# EAGLE schematic Schematic_RoleaTheodorIoan_333CA (EAGLE 9.7.0)
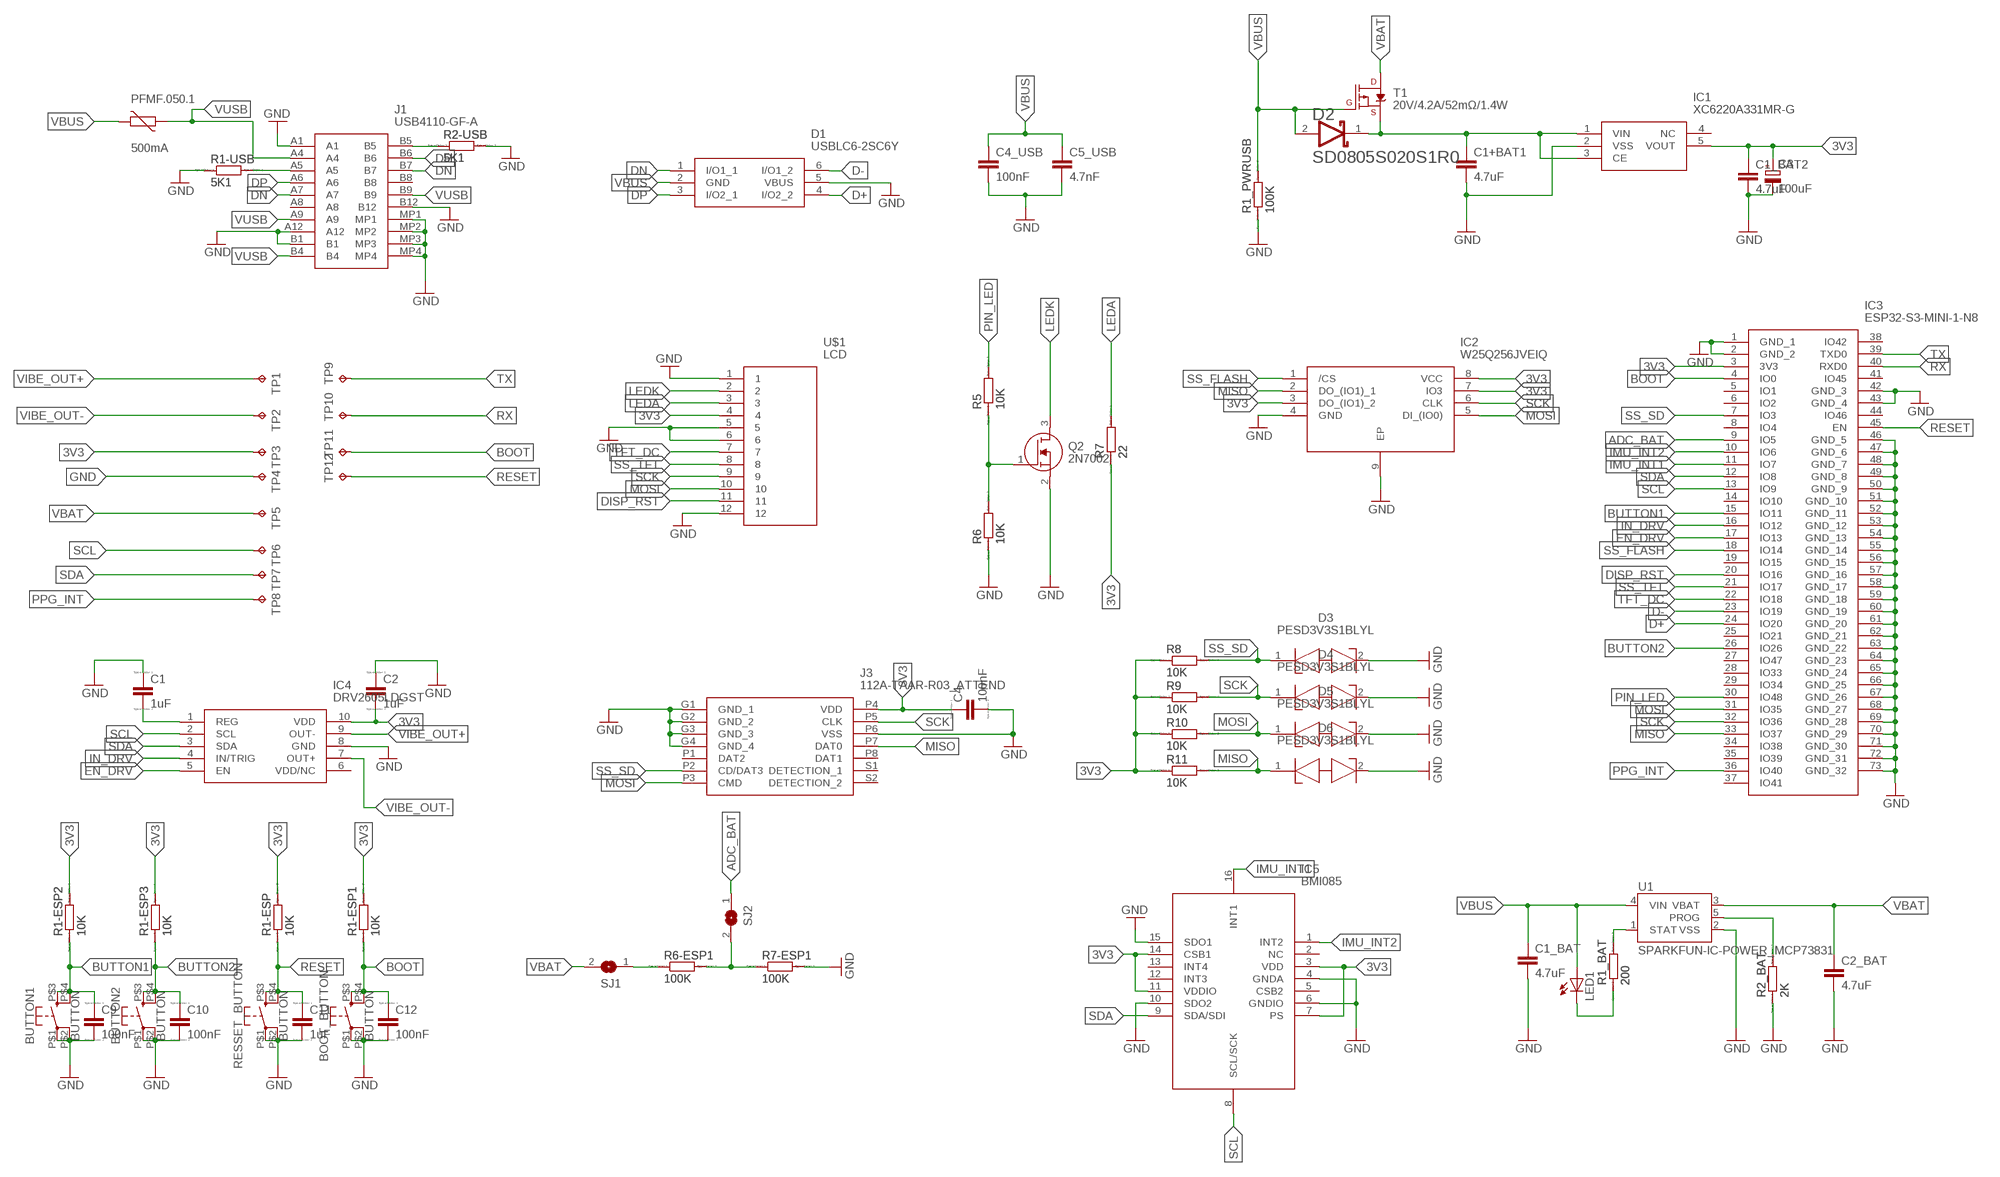
[diagram p0: schematic, sheet 1]

## Parts
BOOT_BUTTON  BUTTON  [BUTTON]
BUTTON1  BUTTON  [BUTTON]
BUTTON2  BUTTON  [BUTTON]
C1  1uF  EAGLE-LTSPICE_CC0402  [EAGLE-LTSPICE_C0402]
C1+BAT1  4.7uF  RCL_C-EUC0603  [RCL_C0603]
C1_BAT  4.7uF  RCL_C-EUC0603  [RCL_C0603]
C1_BAT2  4.7uF  RCL_C-EUC0603  [RCL_C0603]
C2  1uF  EAGLE-LTSPICE_CC0402  [EAGLE-LTSPICE_C0402]
C2_BAT  4.7uF  RCL_C-EUC0603  [RCL_C0603]
C3  100uF  CPOL-EUCT3528  [CT3528]
C4  100nF  EAGLE-LTSPICE_CC0402  [EAGLE-LTSPICE_C0402]
C4_USB  100nF  RCL_C-EUC0603  [RCL_C0603]
C5_USB  4.7nF  RCL_C-EUC0603  [RCL_C0603]
C9  100nF  EAGLE-LTSPICE_CC0402  [EAGLE-LTSPICE_C0402]
C10  100nF  EAGLE-LTSPICE_CC0402  [EAGLE-LTSPICE_C0402]
C11  1uF  EAGLE-LTSPICE_CC0402  [EAGLE-LTSPICE_C0402]
C12  100nF  EAGLE-LTSPICE_CC0402  [EAGLE-LTSPICE_C0402]
D1  USBLC6-2SC6Y  [SOT95P280X145-6N]
D2  AVX---SD0805S020S1R0_AVX_SD0805S020S1R0AVX_SD0805S020S1R0_0_0  [AVX---SD0805S020S1R0_AVX_SD0805S020S1R0_0]
D3  PESD3V3S1BLYL  [PESD5V0S1BL315]
D4  PESD3V3S1BLYL  [PESD5V0S1BL315]
D5  PESD3V3S1BLYL  [PESD5V0S1BL315]
D6  PESD3V3S1BLYL  [PESD5V0S1BL315]
IC1  XC6220A331MR-G  [SOT95P280X120-5N]
IC2  W25Q256JVEIQ  [SON127P800X600X80-9N]
IC3  ESP32-S3-MINI-1-N8  [ESP32S3MINI1N8]
IC4  DRV2605LDGST  [SOP50P490X110-10N]
IC5  BMI085  [BMI085]
J1  USB4110-GF-A  [USB4110GFA]
J3  112A-TAAR-R03_ATTEND  [112ATAARR03ATTEND]
LED1  ADAFRUIT_LEDCHIP-LED0603  [ADAFRUIT_CHIP-LED0603]
PFMF.050.1  500mA  VARISTOR_VARISTORCN1812  [VARISTOR_CT/CN1812]
Q2  2N7002  [SOT96P240X120-3N]
R1-ESP  10K  EAGLE-LTSPICE_RR0402  [EAGLE-LTSPICE_R0402]
R1-ESP1  10K  EAGLE-LTSPICE_RR0402  [EAGLE-LTSPICE_R0402]
R1-ESP2  10K  EAGLE-LTSPICE_RR0402  [EAGLE-LTSPICE_R0402]
R1-ESP3  10K  EAGLE-LTSPICE_RR0402  [EAGLE-LTSPICE_R0402]
R1-USB  5K1  EAGLE-LTSPICE_RR0402  [EAGLE-LTSPICE_R0402]
R1_BAT  200  EAGLE-LTSPICE_RR0402  [EAGLE-LTSPICE_R0402]
R1_PWRUSB  100K  EAGLE-LTSPICE_RR0402  [EAGLE-LTSPICE_R0402]
R2-USB  5K1  EAGLE-LTSPICE_RR0402  [EAGLE-LTSPICE_R0402]
R2_BAT  2K  EAGLE-LTSPICE_RR0402  [EAGLE-LTSPICE_R0402]
R5  10K  EAGLE-LTSPICE_RR0402  [EAGLE-LTSPICE_R0402]
R6  10K  EAGLE-LTSPICE_RR0402  [EAGLE-LTSPICE_R0402]
R6-ESP1  100K  EAGLE-LTSPICE_RR0402  [EAGLE-LTSPICE_R0402]
R7  22  EAGLE-LTSPICE_RR0402  [EAGLE-LTSPICE_R0402]
R7-ESP1  100K  EAGLE-LTSPICE_RR0402  [EAGLE-LTSPICE_R0402]
R8  10K  EAGLE-LTSPICE_RR0402  [EAGLE-LTSPICE_R0402]
R9  10K  EAGLE-LTSPICE_RR0402  [EAGLE-LTSPICE_R0402]
R10  10K  EAGLE-LTSPICE_RR0402  [EAGLE-LTSPICE_R0402]
R11  10K  EAGLE-LTSPICE_RR0402  [EAGLE-LTSPICE_R0402]
RESSET_BUTTON  BUTTON  [BUTTON]
SJ1  SJ  [SJ]
SJ2  SJ  [SJ]
T1  20V/4.2A/52mΩ/1.4W  SPARKFUN-DISCRETESEMI_MOSFET_PCH-SI2309DS  [SPARKFUN-DISCRETESEMI_SOT23-3]
TP1  TPTP20R  [TP20R]
TP2  TPTP20R  [TP20R]
TP3  TPTP20R  [TP20R]
TP4  TPTP20R  [TP20R]
TP5  TPTP20R  [TP20R]
TP6  TPTP20R  [TP20R]
TP7  TPTP20R  [TP20R]
TP8  TPTP20R  [TP20R]
TP9  TPTP20R  [TP20R]
TP10  TPTP20R  [TP20R]
TP11  TPTP20R  [TP20R]
TP12  TPTP20R  [TP20R]
U1  SPARKFUN-IC-POWER_MCP73831  [SPARKFUN-IC-POWER_SOT23-5]
U$1  LCD  [LCD_CONNECTOR]

## Nets
3V3: C1_BAT2.1 C2.2 C3.+ C4.1 IC1.5(VOUT) IC2.3(DO_(IO1)_2) IC2.7(IO3) IC2.8(VCC) IC3.3(3V3) IC4.10(VDD) IC5.3(VDD) IC5.7(PS) IC5.11(VDDIO) IC5.14(CSB1) J3.P4(VDD) R1-ESP1.2 R1-ESP2.2 R1-ESP3.2 R1-ESP.2 R7.1 R8.1 R9.1 R10.1 R11.1 TP3.TP U$1.4
ADC_BAT: IC3.9(IO5) SJ2.1
BOOT: BOOT_BUTTON.P$3 BOOT_BUTTON.P$4 C12.1 IC3.4(IO0) R1-ESP1.1 TP11.TP
BUTTON1: BUTTON1.P$3 BUTTON1.P$4 C9.1 IC3.15(IO11) R1-ESP2.1
BUTTON2: BUTTON2.P$3 BUTTON2.P$4 C10.1 IC3.26(IO26) R1-ESP3.1
D+: D1.4(I/O2_2) IC3.24(IO20)
D-: D1.6(I/O1_2) IC3.23(IO19)
DISP_RST: IC3.20(IO16) U$1.11
DN: D1.1(I/O1_1) J1.A7 J1.B7
DP: D1.3(I/O2_1) J1.A6 J1.B6
EN_DRV: IC3.17(IO13) IC4.5(EN)
GND: BOOT_BUTTON.P$1 BOOT_BUTTON.P$2 BUTTON1.P$1 BUTTON1.P$2 BUTTON2.P$1 BUTTON2.P$2 C1+BAT1.2 C1.1 C1_BAT2.2 C1_BAT.2 C2.1 C2_BAT.2 C3.- C4.2 C4_USB.2 C5_USB.2 C9.2 C10.2 C11.2 C12.2 D1.5(VBUS) D3.2(K2) D4.2(K2) D5.2(K2) D6.2(K2) IC1.2(VSS) IC2.4(GND) IC2.9(EP) IC3.1(GND_1) IC3.2(GND_2) IC3.42(GND_3) IC3.43(GND_4) IC3.46(GND_5) IC3.47(GND_6) IC3.48(GND_7) IC3.49(GND_8) IC3.50(GND_9) IC3.51(GND_10) IC3.52(GND_11) IC3.53(GND_12) IC3.54(GND_13) IC3.55(GND_14) IC3.56(GND_15) IC3.57(GND_16) IC3.58(GND_17) IC3.59(GND_18) IC3.60(GND_19) IC3.61(GND_20) IC3.62(GND_21) IC3.63(GND_22) IC3.64(GND_23) IC3.65(GND_24) IC3.66(GND_25) IC3.67(GND_26) IC3.68(GND_27) IC3.69(GND_28) IC3.70(GND_29) IC3.71(GND_30) IC3.72(GND_31) IC3.73(GND_32) IC4.8(GND) IC5.4(GNDA) IC5.6(GNDIO) IC5.10(SDO2) IC5.15(SDO1) J1.A1 J1.A12 J1.B1 J1.B12 J1.MP1 J1.MP2 J1.MP3 J1.MP4 J3.G1(GND_1) J3.G2(GND_2) J3.G3(GND_3) J3.G4(GND_4) J3.P6(VSS) Q2.2(S) R1-USB.1 R1_PWRUSB.1 R2-USB.2 R2_BAT.1 R6.1 R7-ESP1.2 RESSET_BUTTON.P$1 RESSET_BUTTON.P$2 TP4.TP U1.2(VSS) U$1.1 U$1.5 U$1.6 U$1.12
IMU_INT1: IC3.11(IO7) IC5.16(INT1)
IMU_INT2: IC3.10(IO6) IC5.1(INT2)
IN_DRV: IC3.16(IO12) IC4.4(IN/TRIG)
LEDA: R7.2 U$1.3
LEDK: Q2.3(D) U$1.2
MISO: D6.1(K1) IC2.2(DO_(IO1)_1) IC3.33(IO37) J3.P7(DAT0) R11.2
MOSI: D5.1(K1) IC2.5(DI_(IO0)) IC3.31(IO35) J3.P3(CMD) R10.2 U$1.10
N$1: J1.B5 R2-USB.1
N$2: R6-ESP1.1 SJ1.1
N$3: C1+BAT1.1 D2.1(CATHODE) IC1.1(VIN) IC1.3(CE) T1.2(S)
N$4: C1.2 IC4.1(REG)
N$7: Q2.1(G) R5.1 R6.2
N$8: R6-ESP1.2 R7-ESP1.1 SJ2.2
N$10: R1_BAT.2 U1.1(STAT)
N$12: R2_BAT.2 U1.5(PROG)
N$13: J1.A5 R1-USB.2
N$16: LED1.C R1_BAT.1
PIN_LED: IC3.30(IO48) R5.2
PPG_INT: IC3.36(IO40) TP8.TP
RESET: C11.1 IC3.45(EN) R1-ESP.1 RESSET_BUTTON.P$3 RESSET_BUTTON.P$4 TP12.TP
RX: IC3.40(RXD0) TP10.TP
SCK: D4.1(K1) IC2.6(CLK) IC3.32(IO36) J3.P5(CLK) R9.2 U$1.9
SCL: IC3.13(IO9) IC4.2(SCL) IC5.8(SCL/SCK) TP6.TP
SDA: IC3.12(IO8) IC4.3(SDA) IC5.9(SDA/SDI) TP7.TP
SS_FLASH: IC2.1(/CS) IC3.18(IO14)
SS_SD: D3.1(K1) IC3.7(IO3) J3.P2(CD/DAT3) R8.2
SS_TFT: IC3.21(IO17) U$1.8
TFT_DC: IC3.22(IO18) U$1.7
TX: IC3.39(TXD0) TP9.TP
VBAT: C2_BAT.1 SJ1.2 T1.3(D) TP5.TP U1.3(VBAT)
VBUS: C1_BAT.1 C4_USB.1 C5_USB.1 D1.2(GND) D2.2(ANODE) LED1.A PFMF.050.1.2 R1_PWRUSB.2 T1.1(G) U1.4(VIN)
VIBE_OUT+: IC4.9(OUT-) TP1.TP
VIBE_OUT-: IC4.7(OUT+) TP2.TP
VUSB: J1.A4 J1.A9 J1.B4 J1.B9 PFMF.050.1.1
Unconnected: IC1.4(NC) IC3.5(IO1) IC3.6(IO2) IC3.8(IO4) IC3.14(IO10) IC3.19(IO15) IC3.25(IO21) IC3.27(IO47) IC3.28(IO33) IC3.29(IO34) IC3.34(IO38) IC3.35(IO39) IC3.37(IO41) IC3.38(IO42) IC3.41(IO45) IC3.44(IO46) IC4.6(VDD/NC) IC5.2(NC) IC5.5(CSB2) IC5.12(INT3) IC5.13(INT4) J1.A8 J1.B8 J3.P1(DAT2) J3.P8(DAT1) J3.S1(DETECTION_1) J3.S2(DETECTION_2)

## Library data of the parts
BOOT_BUTTON BUTTON1 BUTTON2 RESSET_BUTTON = Hector_Watch:BUTTON
C1 C2 C4 C9-C12 = Hector_Watch:EAGLE-LTSPICE_C: CAPACITOR, European symbol; SPICEMODEL: NONE; SPICEPREFIX: C
C1+BAT1 C1_BAT C1_BAT2 C2_BAT C4_USB C5_USB = Hector_Watch:RCL_C-EU: CAPACITOR, European symbol; SPICEPREFIX: C
C3 = Hector_Watch:CPOL-EU: POLARIZED CAPACITOR, European symbol; SPICEPREFIX: C
D1 = Hector_Watch:USBLC6-2SC6Y: Low Cap. ESD Protection Auto SOT-23-6 STMicroelectronics USBLC6-2SC6Y, Dual Uni-Directional TVS Diode Array, 6-Pin SOT-23 Source: Datasheet <https://componentsearchengine.com/Datasheets/1/USBLC6-2SC6Y.pdf>; ARROW_PART_NUMBER: USBLC6-2SC6Y; ARROW_PRICE-STOCK: https://www.arrow.com/en/products/usblc6-2sc6y/stmicroelectronics?region=nac; DESCRIPTION: Low Cap. ESD Protection Auto SOT-23-6 STMicroelectronics USBLC6-2SC6Y, Dual Uni-Directional TVS Diode Array, 6-Pin SOT-23; HEIGHT: 1.45mm; MANUFACTURER_NAME: STMicroelectronics; MANUFACTURER_PART_NUMBER: USBLC6-2SC6Y; MOUSER_PART_NUMBER: 511-USBLC6-2SC6Y; MOUSER_PRICE-STOCK: https://www.mouser.co.uk/ProductDetail/STMicroelectronics/USBLC6-2SC6Y?qs=gNDSiZmRJS%2FOgDexvXkdow%3D%3D
D2 = Hector_Watch:AVX---SD0805S020S1R0_AVX_SD0805S020S1R0: Schottky Barrier Rectifier Diode; CENTROID_NOT_SPECIFIED: No; DATASHEET: http://datasheets.avx.com/schottky.pdf; DIGIKEY_DESCRIPTION: DIODE SCHOTTKY 20V 1A 0805; DIGIKEY_PART_NUMBER: 478-7800-1-ND; LEAD_FREE: yes; MF: AVX; MOUSER_PART_NUMBER: 581-SD0805S020S1R0; MPN: SD0805S020S1R0; PACKAGE: 0805 (2012 metric); PREFIX: D; ROHS: yes; TEMPERATURE_RANGE_HIGH: +125°C; TEMPERATURE_RANGE_LOW: -55°C
D3-D6 = Hector_Watch:PESD3V3S1BLYL: PESD3V3S1BL - Low capacitance bidirectional ESD protection diode Source: Datasheet <https://assets.nexperia.com/documents/data-sheet/PESD3V3S1BL.pdf>; ARROW_PART_NUMBER: PESD3V3S1BLYL; ARROW_PRICE-STOCK: https://www.arrow.com/en/products/pesd3v3s1blyl/nexperia?region=nac; DESCRIPTION: PESD3V3S1BL - Low capacitance bidirectional ESD protection diode; HEIGHT: 0mm; MANUFACTURER_NAME: Nexperia; MANUFACTURER_PART_NUMBER: PESD3V3S1BLYL; MOUSER_PART_NUMBER: 771-PESD3V3S1BLYL; MOUSER_PRICE-STOCK: https://www.mouser.co.uk/ProductDetail/Nexperia/PESD3V3S1BLYL?qs=vLWxofP3U2zWoKHYJMVoKQ%3D%3D
IC1 = Hector_Watch:XC6220A331MR-G: LDO Voltage Regulators Source: Datasheet <https://www.torexsemi.com/file/xc6220/XC6220.pdf>; DESCRIPTION: LDO Voltage Regulators; HEIGHT: 1.2mm; MANUFACTURER_NAME: Torex; MANUFACTURER_PART_NUMBER: XC6220A331MR-G; MOUSER_PART_NUMBER: 865-XC6220A331MR-G; MOUSER_PRICE-STOCK: https://www.mouser.co.uk/ProductDetail/Torex-Semiconductor/XC6220A331MR-G?qs=AsjdqWjXhJ8ZSWznL1J0gg%3D%3D
IC2 = Hector_Watch:W25Q256JVEIQ: 256M-bit Serial Flash Memory with uniform 4KB sectors and Dual/Quad SPI Source: Datasheet <https://www.winbond.com/hq/search-resource-file.jsp?partNo=W25Q256JVEIQ&type=datasheet>; ARROW_PART_NUMBER: W25Q256JVEIQ; ARROW_PRICE-STOCK: https://www.arrow.com/en/products/w25q256jveiq/winbond-electronics?region=nac; DESCRIPTION: 256M-bit Serial Flash Memory with uniform 4KB sectors and Dual/Quad SPI; HEIGHT: 0.8mm; MANUFACTURER_NAME: Winbond; MANUFACTURER_PART_NUMBER: W25Q256JVEIQ; MOUSER_PART_NUMBER: 454-W25Q256JVEIQ; MOUSER_PRICE-STOCK: https://www.mouser.co.uk/ProductDetail/Winbond/W25Q256JVEIQ?qs=qSfuJ%252Bfl%2Fd4o%2FNFUf7yCgA%3D%3D
IC3 = Hector_Watch:ESP32-S3-MINI-1-N8: WiFi Development Tools - 802.11 [Engineering Samples] SMD Module, ESP32-S3FN8, 8 MB SPI Flash, PCB Antenna Source: Datasheet <https://www.espressif.com/sites/default/files/documentation/esp32-s3-mini-1_mini-1u_datasheet_en.pdf>; DESCRIPTION: WiFi Development Tools - 802.11 [Engineering Samples] SMD Module, ESP32-S3FN8, 8 MB SPI Flash, PCB Antenna; HEIGHT: 2.55mm; MANUFACTURER_NAME: Espressif Systems; MANUFACTURER_PART_NUMBER: ESP32-S3-MINI-1-N8; MOUSER_PART_NUMBER: 356-ESP32-S3-MINI1N8; MOUSER_PRICE-STOCK: https://www.mouser.co.uk/ProductDetail/Espressif-Systems/ESP32-S3-MINI-1-N8?qs=XAiT9M5g4x82rl6F%2FIYUQg%3D%3D
IC4 = Hector_Watch:DRV2605LDGST: ERM & LRA Device Haptic Driver 2-5V BGA9 Texas Instruments DRV2605LDGST Piezo Haptic Motor Driver IC, 5 V, 10-Pin VSSOP Source: Datasheet <http://www.ti.com/lit/ds/symlink/drv2605l.pdf>; ARROW_PART_NUMBER: DRV2605LDGST; ARROW_PRICE-STOCK: https://www.arrow.com/en/products/drv2605ldgst/texas-instruments?region=nac; DESCRIPTION: ERM & LRA Device Haptic Driver 2-5V BGA9 Texas Instruments DRV2605LDGST Piezo Haptic Motor Driver IC, 5 V, 10-Pin VSSOP; HEIGHT: 1.1mm; MANUFACTURER_NAME: Texas Instruments; MANUFACTURER_PART_NUMBER: DRV2605LDGST; MOUSER_PART_NUMBER: 595-DRV2605LDGST; MOUSER_PRICE-STOCK: https://www.mouser.co.uk/ProductDetail/Texas-Instruments/DRV2605LDGST?qs=asCBFxFfL1TjvcNdZsR2BA%3D%3D
IC5 = Hector_Watch:BMI085: IMUs - Inertial Measurement Units High-performance IMU BMI085 for virtual and augmented reality applications Source: Datasheet <https://ae-bst.resource.bosch.com/media/_tech/media/datasheets/BST-BMI085-DS001.pdf>; ARROW_PART_NUMBER: BMI085; ARROW_PRICE-STOCK: https://www.arrow.com/en/products/bmi085/bosch; DESCRIPTION: IMUs - Inertial Measurement Units High-performance IMU BMI085 for virtual and augmented reality applications; HEIGHT: 1mm; MANUFACTURER_NAME: BOSCH; MANUFACTURER_PART_NUMBER: BMI085; MOUSER_PART_NUMBER: 262-BMI085; MOUSER_PRICE-STOCK: https://www.mouser.co.uk/ProductDetail/Bosch-Sensortec/BMI085?qs=y6ZabgHbY%252ByGCM8LfWZyqA%3D%3D
J1 = Hector_Watch:USB4110-GF-A: CONN USB 2.0 TYPE-C R/A SMT Source: Datasheet <https://gct.co/files/drawings/usb4110.pdf>; DESCRIPTION: CONN USB 2.0 TYPE-C R/A SMT; HEIGHT: 3.26mm; MANUFACTURER_NAME: GCT (GLOBAL CONNECTOR TECHNOLOGY); MANUFACTURER_PART_NUMBER: USB4110-GF-A; MOUSER_PART_NUMBER: 640-USB4110-GF-A; MOUSER_PRICE-STOCK: https://www.mouser.co.uk/ProductDetail/GCT/USB4110-GF-A?qs=KUoIvG%2F9IlYiZvIXQjyJeA%3D%3D
J3 = Hector_Watch:112A-TAAR-R03_ATTEND: Micro SD Card Socket, Push-Push Type, Top Mount, SMT, H=1.83mm, 10u Source: Datasheet <https://www.attend.com.tw/data/download/file/112A-TAAR-R03.pdf>; DESCRIPTION: Micro SD Card Socket, Push-Push Type, Top Mount, SMT, H=1.83mm, 10u; HEIGHT: 1.9mm; MANUFACTURER_NAME: ATTEND; MANUFACTURER_PART_NUMBER: 112A-TAAR-R03 ATTEND
LED1 = Hector_Watch:ADAFRUIT_LED: LED OSRAM: - CHIPLED LG R971, LG N971, LY N971, LG Q971, LY Q971, LO R971, LY R971 LH N974, LH R974 LS Q976, LO Q976, LY Q976 LO Q996 - Hyper CHIPLED LW Q18S LB Q993, LB Q99A, LB R99A - SideLED LS A670, LO A670, LY A670, LG A670, LP A670 LB A673, LV A673, LT A673, LW A673 LH A674 LY A675 LS A676, LA A676, LO A676, LY A676, LW A676 LS A679, LY A679, LG A679 - Hyper Micro SIDELED® LS Y876, LA Y876, LO Y876, LY Y876 LT Y87S - SmartLED LW L88C, LW L88S LB L89C, LB L89S, LG L890 LS L89K, LO L89K, LY L89K LS L896, LA L896, LO L896, LY L896 - TOPLED LS T670, LO T670, LY T670, LG T670, LP T670 LSG T670, LSP T670, LSY T670, LOP T670, LYG T670 LG T671, LOG T671, LSG T671 LB T673, LV T673, LT T673, LW T673 LH T674 LS T676, LA T676, LO T676, LY T676, LB T676, LH T676, LSB T676, LW T676 LB T67C, LV T67C, LT T67C, LS T67K, LO T67K, LY T67K, LW E67C LS E67B, LA E67B, LO E67B, LY E67B, LB E67C, LV E67C, LT E67C LW T67C LS T679, LY T679, LG T679 LS T770, LO T770, LY T770, LG T770, LP T770 LB T773, LV T773, LT T773, LW T773 LH T774 LS E675, LA E675, LY E675, LS T675 LS T776, LA T776, LO T776, LY T776, LB T776 LHGB T686 LT T68C, LB T68C - Hyper Mini TOPLED® LB M676 - Mini TOPLED Santana® LG M470 LS M47K, LO M47K, LY M47K Source: http://www.osram.convergy.de/
PFMF.050.1 = Hector_Watch:VARISTOR_VARISTOR: VARISTOR
Q2 = Hector_Watch:2N7002: N-channel MOSFET,2N7002 0.115A 60V Source: Datasheet <https://www.onsemi.com/pub/Collateral/NDS7002A-D.PDF>; ARROW_PART_NUMBER: 2N7002; ARROW_PRICE-STOCK: https://www.arrow.com/en/products/2n7002/on-semiconductor?region=europe; DESCRIPTION: N-channel MOSFET,2N7002 0.115A 60V; HEIGHT: 1.2mm; MANUFACTURER_NAME: onsemi; MANUFACTURER_PART_NUMBER: 2N7002; MOUSER_PART_NUMBER: 512-2N7002; MOUSER_PRICE-STOCK: https://www.mouser.co.uk/ProductDetail/onsemi-Fairchild/2N7002?qs=0dwsXDNhqlz66WJJhrTFjQ%3D%3D
R1-ESP R1-ESP1-R1-ESP3 R1-USB R1_BAT R1_PWRUSB R2-USB R2_BAT R5 R6 R6-ESP1 R7 R7-ESP1 R8-R11 = Hector_Watch:EAGLE-LTSPICE_R: RESISTOR, European symbol; SPICEMODEL: NONE; SPICEPREFIX: R
SJ1 SJ2 = Hector_Watch:SJ: SMD solder JUMPER
T1 = Hector_Watch:SPARKFUN-DISCRETESEMI_MOSFET_PCH: P-channel MOSFETs Voltage controlled devices that allow control of high current outputs. SparkFun Products: SparkFun ESP32 Thing <https://www.sparkfun.com/products/13907> SparkFun ESP8266 Thing <https://www.sparkfun.com/products/13231> SparkFun Pi Servo HAT V2 <https://www.sparkfun.com/products/15316> DMG2305UX-7 (20V/4.2A/SOT23-3); PROD_ID: TRANS-14715; VALUE: 9A/30V/15mΩ
TP1-TP12 = Hector_Watch:TP: Test pad
U1 = Hector_Watch:SPARKFUN-IC-POWER_MCP73831: MCP73831T Li-Ion, Li-Pol Controller Miniature single cell, fully integrated Li-Ion, Li-polymer charge management controller Datasheet <http://ww1.microchip.com/downloads/en/DeviceDoc/20001984g.pdf> SparkFun Products: SparkFun ESP32 Thing <https://www.sparkfun.com/products/13907> SparkFun 9DoF Razor IMU M0 <https://www.sparkfun.com/products/14001>; PROD_ID: IC-09995
U$1 = Hector_Watch:LCD